# Altium schematic sheet 50YXJ22M5X111_50YXJ22M5X11.schdoc
size 127 x 101 mm
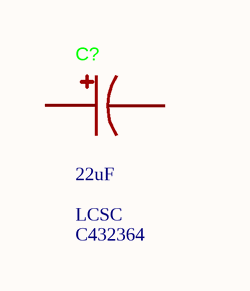
[diagram p0: 50YXJ22M5X111_50YXJ22M5X11.schdoc]

## Parts
C?  Supplier: LCSC  Supplier Part: C432364  [CAP-TH_BD5.0-P2.00-D0.5-FD-1]  (hidden comment: 22uF)

## Nets

Not connected (* = marked no-connect by the designer): C? 1 2

## Library data of the parts
C? = 50YXJ22M5X11: Manufacturer: rubycon(红宝石); Add into BOM: yes; Tolerance: ±20%; Symbol: 50YXJ22M5X11; Device: 50YXJ22M5X11; Manufacturer Part: 50YXJ22M5X11; Value: 22uF; LCSC Part Name: 22uF ±20% 50V; Supplier Footprint: 插件,D5xL11mm; JLCPCB Part Class: Extended Part; Datasheet: https://atta.szlcsc.com/upload/public/pdf/source/20190927/C432444_D90212164DBC1B856ABE912664018FD4.pdf; Convert to PCB: yes; Ripple Current: -; Equivalent Series Resistance(ESR): -; Lead Spacing: 2mm; Lifetime @ Temp: -